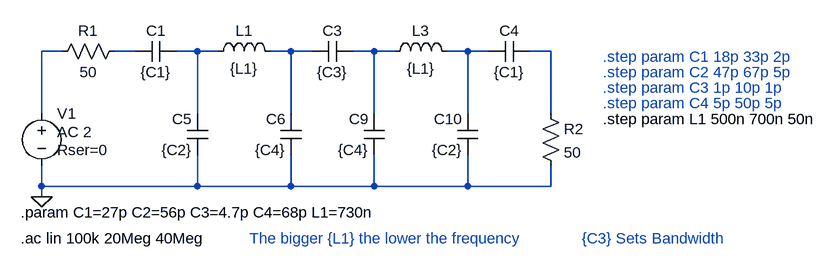
[diagram p0: schematic BandPass30M.asc]
BandPass30M.asc, the LTspice schematic file:
Version 4
SHEET 1 880 680
WIRE -2592 80 -2624 80
WIRE -2480 80 -2512 80
WIRE -2384 80 -2416 80
WIRE -2352 80 -2384 80
WIRE -2240 80 -2272 80
WIRE -2208 80 -2240 80
WIRE -2112 80 -2144 80
WIRE -2080 80 -2112 80
WIRE -1968 80 -2000 80
WIRE -1936 80 -1968 80
WIRE -1840 80 -1872 80
WIRE -2624 176 -2624 80
WIRE -2384 176 -2384 80
WIRE -2240 176 -2240 80
WIRE -2112 176 -2112 80
WIRE -1968 176 -1968 80
WIRE -1840 176 -1840 80
WIRE -2624 288 -2624 256
WIRE -2384 288 -2384 240
WIRE -2384 288 -2624 288
WIRE -2240 288 -2240 240
WIRE -2240 288 -2384 288
WIRE -2112 288 -2112 240
WIRE -2112 288 -2240 288
WIRE -1968 288 -1968 240
WIRE -1968 288 -2112 288
WIRE -1840 288 -1840 256
WIRE -1840 288 -1968 288
WIRE -2624 304 -2624 288
FLAG -2624 304 0
SYMBOL ind -2368 96 R270
WINDOW 0 32 56 VTop 2
WINDOW 3 5 56 VBottom 2
SYMATTR InstName L1
SYMATTR Value {L1}
SYMBOL voltage -2624 160 R0
WINDOW 3 24 44 Left 2
WINDOW 123 24 44 Left 2
WINDOW 39 24 72 Left 2
SYMATTR Value ""
SYMATTR Value2 AC 2
SYMATTR SpiceLine Rser=0
SYMATTR InstName V1
SYMBOL cap -2416 64 R90
WINDOW 0 0 32 VBottom 2
WINDOW 3 32 32 VTop 2
SYMATTR InstName C1
SYMATTR Value {C1}
SYMBOL res -2608 96 R270
WINDOW 0 32 56 VTop 2
WINDOW 3 0 56 VBottom 2
SYMATTR InstName R1
SYMATTR Value 50
SYMBOL cap -2368 240 R180
WINDOW 0 24 56 Left 2
WINDOW 3 24 8 Left 2
SYMATTR InstName C5
SYMATTR Value {C2}
SYMBOL cap -2224 240 R180
WINDOW 0 24 56 Left 2
WINDOW 3 24 8 Left 2
SYMATTR InstName C6
SYMATTR Value {C4}
SYMBOL cap -2144 64 R90
WINDOW 0 0 32 VBottom 2
WINDOW 3 32 32 VTop 2
SYMATTR InstName C3
SYMATTR Value {C3}
SYMBOL ind -2096 96 R270
WINDOW 0 32 56 VTop 2
WINDOW 3 5 56 VBottom 2
SYMATTR InstName L3
SYMATTR Value {L1}
SYMBOL cap -2096 240 R180
WINDOW 0 24 56 Left 2
WINDOW 3 24 8 Left 2
SYMATTR InstName C9
SYMATTR Value {C4}
SYMBOL cap -1952 240 R180
WINDOW 0 24 56 Left 2
WINDOW 3 24 8 Left 2
SYMATTR InstName C10
SYMATTR Value {C2}
SYMBOL cap -1872 64 R90
WINDOW 0 0 32 VBottom 2
WINDOW 3 32 32 VTop 2
SYMATTR InstName C4
SYMATTR Value {C1}
SYMBOL res -1856 160 R0
SYMATTR InstName R2
SYMATTR Value 50
TEXT -2656 368 Left 2 !.ac lin 100k 20Meg 40Meg
TEXT -2656 328 Left 2 !.param C1=27p C2=56p C3=4.7p C4=68p L1=730n
TEXT -1760 184 Left 2 !.step param L1 500n 700n 50n
TEXT -1792 368 Left 2 ;{C3} Sets Bandwidth
TEXT -2304 368 Left 2 ;The bigger {L1} the lower the frequency
TEXT -1760 160 Left 2 ;.step param C4 5p 50p 5p
TEXT -1760 136 Left 2 ;.step param C3 1p 10p 1p
TEXT -1760 112 Left 2 ;.step param C2 47p 67p 5p
TEXT -1760 88 Left 2 ;.step param C1 18p 33p 2p

The netlist it stands for:
* BandPass30M.asc
L1 N003 N004 {L1}
V1 N001 0 AC 2 Rser=0
C1 N003 N002 {C1}
R1 N001 N002 50
C5 0 N003 {C2}
C6 0 N004 {C4}
C3 N005 N004 {C3}
L3 N005 N006 {L1}
C9 0 N005 {C4}
C10 0 N006 {C2}
C4 N007 N006 {C1}
R2 N007 0 50
.ac lin 100k 20Meg 40Meg
.param C1=27p C2=56p C3=4.7p C4=68p L1=730n
.step param L1 500n 700n 50n
* {C3} Sets Bandwidth
* The bigger {L1} the lower the frequency
* .step param C4 5p 50p 5p
* .step param C3 1p 10p 1p
* .step param C2 47p 67p 5p
* .step param C1 18p 33p 2p
.backanno
.end